# Altium schematic sheet connectors.SchDoc
size A3
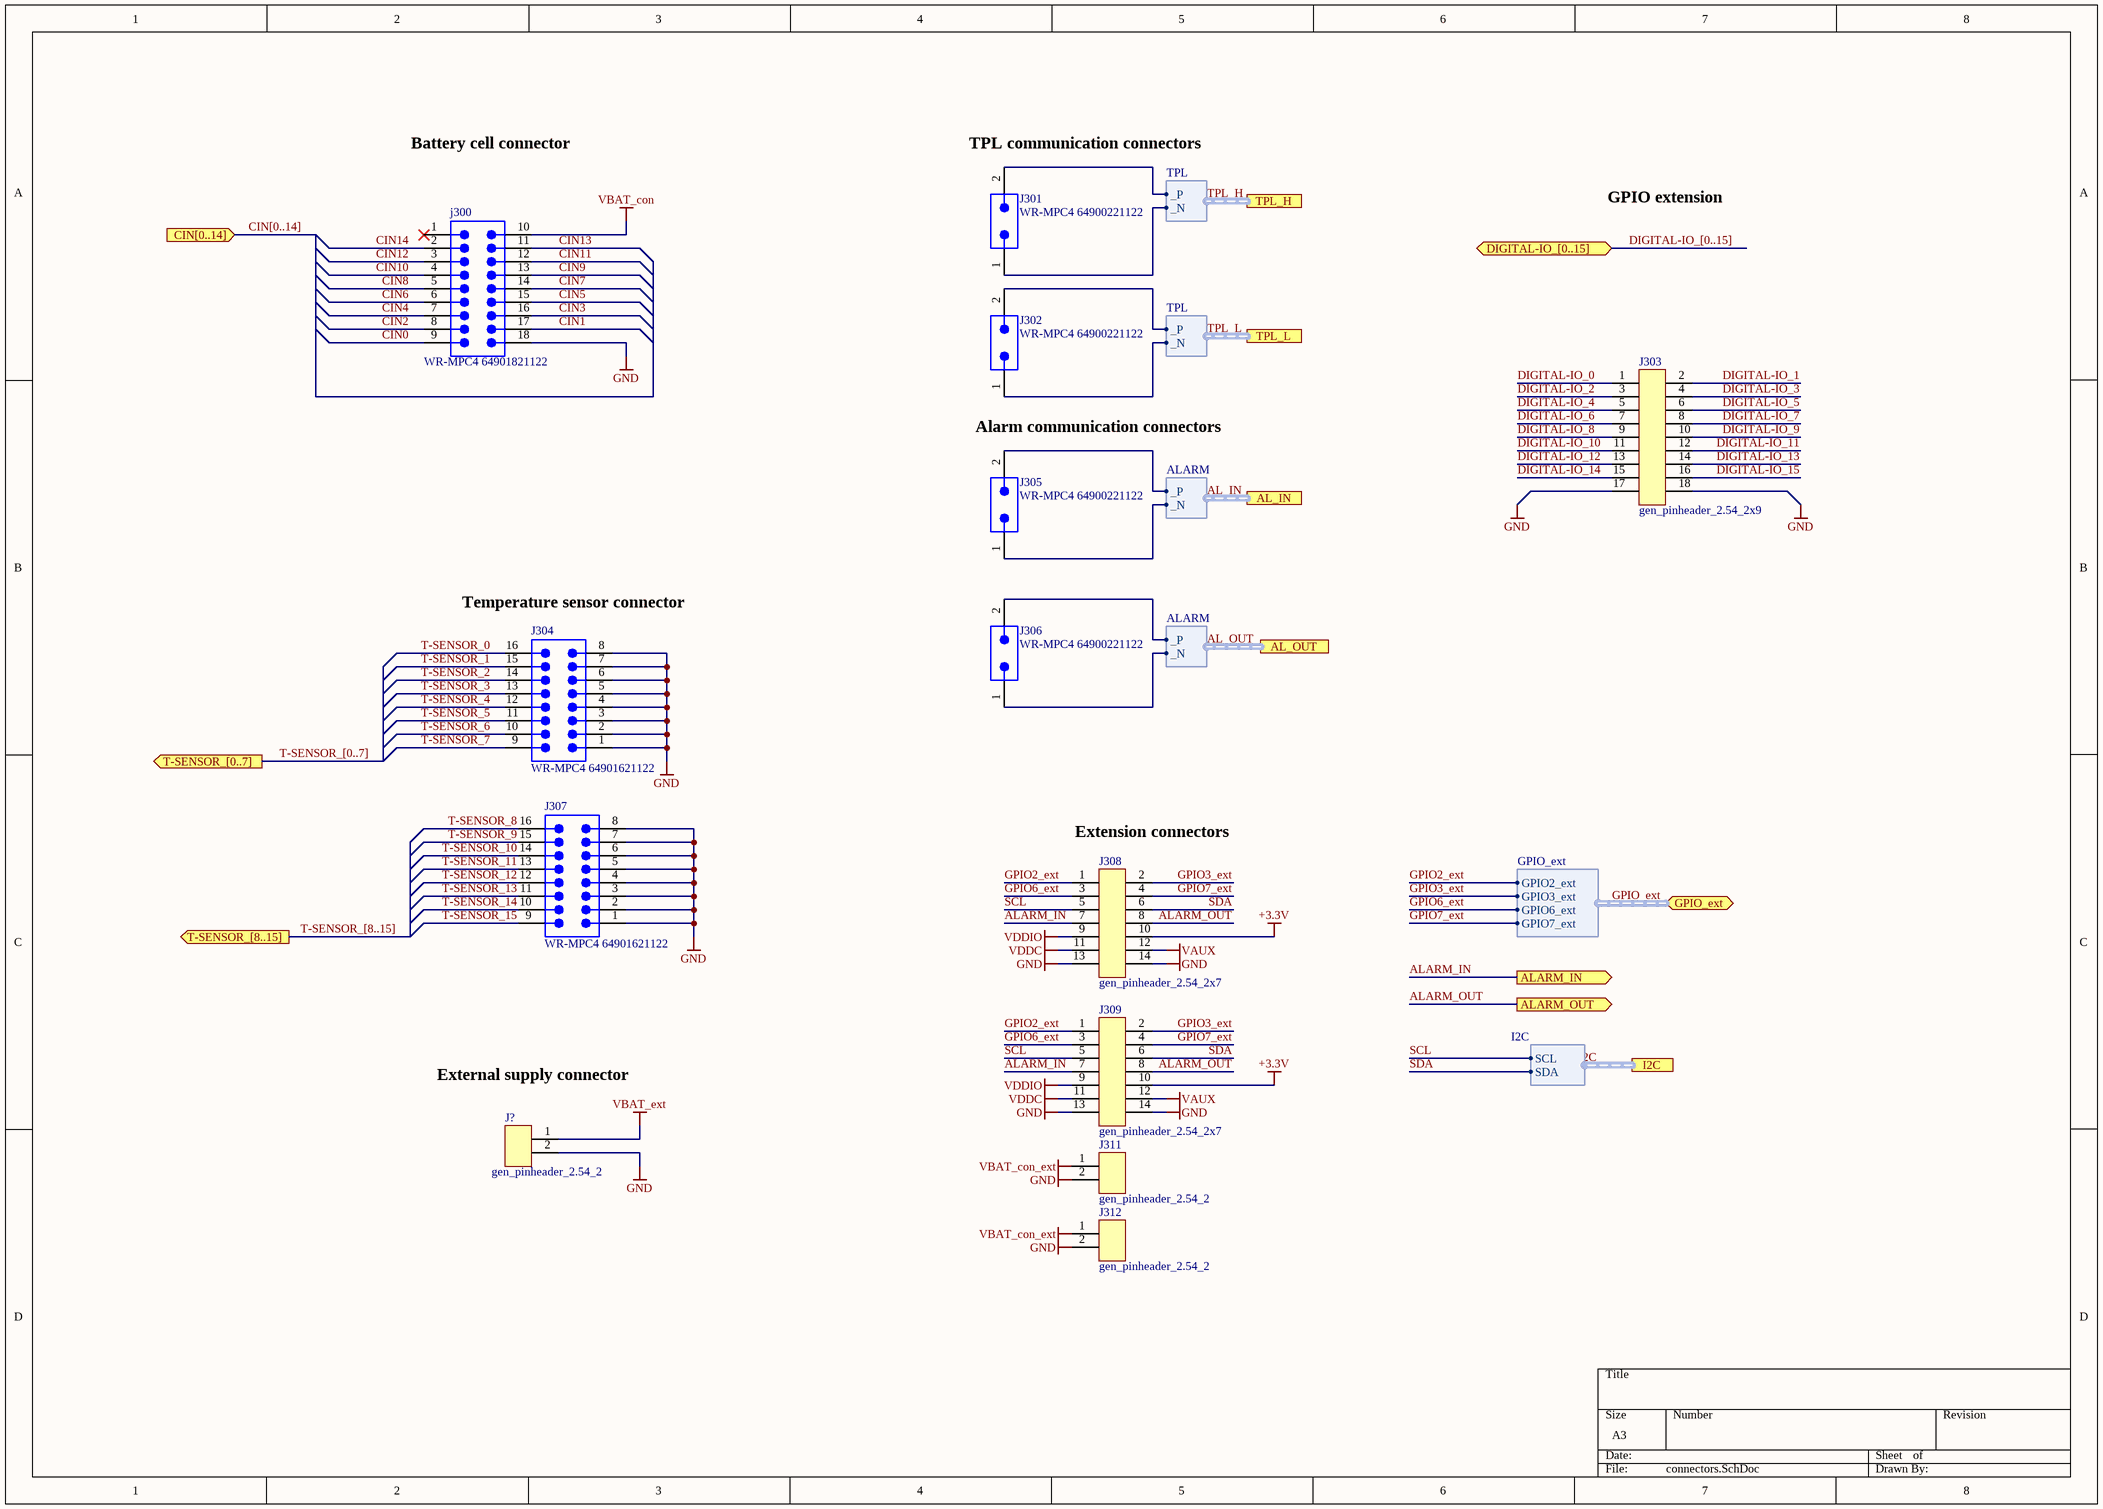
[diagram p0: connectors.SchDoc]

## Parts
j300  WR-MPC4 64901821122  [64901821122]
J301  WR-MPC4 64900221122  [64900221122]
J302  WR-MPC4 64900221122  [64900221122]
J303  gen_pinheader_2.54_2x9  [Pinheader_2.54_2x9]
J304  WR-MPC4 64901621122  [64901621122]
J305  WR-MPC4 64900221122  [64900221122]
J306  WR-MPC4 64900221122  [64900221122]
J307  WR-MPC4 64901621122  [64901621122]
J308  gen_pinheader_2.54_2x7  [Pinheader_2.54_2x7]
J309  gen_pinheader_2.54_2x7  [Pinheader_2.54_2x7]
J311  gen_pinheader_2.54_2  [Pinheader_2.54_2]
J312  gen_pinheader_2.54_2  [Pinheader_2.54_2]
J?  gen_pinheader_2.54_2  [Pinheader_2.54_2]

## Ports
AL_IN (harness ALARM), AL_OUT (harness ALARM), ALARM_IN (out), ALARM_OUT (out), CIN[0..14] (in), DIGITAL-IO_[0..15] (bidir), GPIO_ext (bidir, harness GPIO_ext), I2C (harness I2C), T-SENSOR_[0..7] (out), T-SENSOR_[8..15] (out), TPL_H (harness TPL), TPL_L (harness TPL)

## Harnesses
GPIO_ext: GPIO3_ext, GPIO2_ext, GPIO6_ext, GPIO7_ext
I2C: SCL, SDA
TPL: _P, _N
ALARM: _P, _N

## Nets
+3.3V: J308.10 J309.10
GND: j300.18 J303.17 J303.18 J304.1 J304.2 J304.3 J304.4 J304.5 J304.6 J304.7 J304.8 J307.1 J307.2 J307.3 J307.4 J307.5 J307.6 J307.7 J307.8 J308.13 J308.14 J309.13 J309.14 J311.2 J312.2 J?.2
VAUX: J308.12 J309.12
VBAT_con: j300.10
VBAT_con_ext: J311.1 J312.1
VBAT_ext: J?.1
VDDC: J308.11 J309.11
VDDIO: J308.9 J309.9
AL_IN._N: J305.1 ; port AL_IN._N
AL_IN._P: J305.2 ; port AL_IN._P
AL_OUT._N: J306.1 ; port AL_OUT._N
AL_OUT._P: J306.2 ; port AL_OUT._P
ALARM_IN: J308.7 J309.7 ; port ALARM_IN
ALARM_OUT: J308.8 J309.8 ; port ALARM_OUT
CIN0: j300.9
CIN1: j300.17
CIN2: j300.8
CIN3: j300.16
CIN4: j300.7
CIN5: j300.15
CIN6: j300.6
CIN7: j300.14
CIN8: j300.5
CIN9: j300.13
CIN10: j300.4
CIN11: j300.12
CIN12: j300.3
CIN13: j300.11
CIN14: j300.2
DIGITAL-IO_0: J303.1
DIGITAL-IO_1: J303.2
DIGITAL-IO_2: J303.3
DIGITAL-IO_3: J303.4
DIGITAL-IO_4: J303.5
DIGITAL-IO_5: J303.6
DIGITAL-IO_6: J303.7
DIGITAL-IO_7: J303.8
DIGITAL-IO_8: J303.9
DIGITAL-IO_9: J303.10
DIGITAL-IO_10: J303.11
DIGITAL-IO_11: J303.12
DIGITAL-IO_12: J303.13
DIGITAL-IO_13: J303.14
DIGITAL-IO_14: J303.15
DIGITAL-IO_15: J303.16
GPIO2_ext: J308.1 J309.1 ; port GPIO_ext.GPIO2_ext
GPIO3_ext: J308.2 J309.2 ; port GPIO_ext.GPIO3_ext
GPIO6_ext: J308.3 J309.3 ; port GPIO_ext.GPIO6_ext
GPIO7_ext: J308.4 J309.4 ; port GPIO_ext.GPIO7_ext
SCL: J308.5 J309.5 ; port I2C.SCL  [project net I2C.SCL]
SDA: J308.6 J309.6 ; port I2C.SDA  [project net I2C.SDA]
T-SENSOR_0: J304.16
T-SENSOR_1: J304.15
T-SENSOR_2: J304.14
T-SENSOR_3: J304.13
T-SENSOR_4: J304.12
T-SENSOR_5: J304.11
T-SENSOR_6: J304.10
T-SENSOR_7: J304.9
T-SENSOR_8: J307.16
T-SENSOR_9: J307.15
T-SENSOR_10: J307.14
T-SENSOR_11: J307.13
T-SENSOR_12: J307.12
T-SENSOR_13: J307.11
T-SENSOR_14: J307.10
T-SENSOR_15: J307.9
TPL_H._N: J301.1 ; port TPL_H._N
TPL_H._P: J301.2 ; port TPL_H._P
TPL_L._N: J302.1 ; port TPL_L._N
TPL_L._P: J302.2 ; port TPL_L._P

Not connected (* = marked no-connect by the designer): j300 1*

## Buses and harness runs
bus CIN[0..14] = port CIN[0..14]
bus DIGITAL-IO_[0..15] = port DIGITAL-IO_[0..15]
bus T-SENSOR_[0..7] = port T-SENSOR_[0..7]
bus T-SENSOR_[8..15] = port T-SENSOR_[8..15]
harness AL_IN = port AL_IN
harness AL_OUT = port AL_OUT
harness GPIO_ext = port GPIO_ext
harness I2C = port I2C
harness TPL_H = port TPL_H
harness TPL_L = port TPL_L

## Notes on the sheet
- Battery cell connector
- (near J301) TPL communication connectors
- GPIO extension
- Alarm communication connectors
- (near J304) Temperature sensor connector
- (near J308) Extension connectors
- External supply connector

## Library data of the parts
j300 = CMP-1502-00501-2: NexarPartId: 23024638; Number of Positions: 18; Current Rating: 6A; Gender: Male; Operating Supply Voltage: 600V; Insulation Resistance: 1GΩ; Contact Resistance: 10mΩ; Connector Type: Male Pin, Socket; Row Spacing: 4.191mm; Pitch: 4.2mm; Color: White; Height: 12.8mm; Orientation: Vertical; Width: 39.1mm; Contact Material: Copper; Number of Contacts: 18; Max Operating Temperature: 105°C; Number of Rows: 2; RoHS: Compliant; Min Operating Temperature: -40°C; Contact Plating: Tin; Length: 39mm; Mount: Through Hole; Termination: Solder; Lead Pitch: 4.2mm; REACH SVHC: Unknown; Number of Pins: 18; Fastening Type: Ramp
J301 J302 J305 J306 = CMP-1502-00493-2: NexarPartId: 8917578; Contact Resistance: 10mΩ; Operating Supply Voltage: 600V; Current Rating: 9A; Gender: Male; Number of Contacts: 2; Lead Length: 3.5mm; Connector Type: Male Pin, Socket; Pitch: 4.2mm; Row Spacing: 5.5118mm; Insulation Resistance: 1GΩ; Height: 12.8mm; Max Operating Temperature: 105°C; Color: White; Number of Rows: 2; Voltage Rating: 600V; Termination: Solder; Fastening Type: Ramp; Width: 5.5mm; Min Operating Temperature: -40°C; Length: 5.4mm; Mount: Through Hole; Flammability Rating: UL94 V-0; Contact Gender: Male; Contact Material: Copper; Lead Pitch: 4.2mm; Housing Material: Nylon; Contact Plating: Tin; Number of Pins: 2; RoHS: Compliant; Orientation: Vertical; REACH SVHC: Unknown; Number of Positions: 2
J303 = gen_pinheader_2.54_2x9: Standard Pinheader, THD, gerade, 2.54mm, 2-reihig; Circuits: 18; Rated Voltage: 250V; Rated Current: 3A; Automotive Qualified: False; Part Number: gen_pinheader_2.54_2x9; Part Name: PinHeader; Operating Temperature: −40 °C - +105 °C; Supplier 1: Farnell; Supplier Part Number 1: 2025256
J304 J307 = CMP-1502-00500-2: NexarPartId: 23024631; Pitch: 4.2mm; Gender: Male; Row Spacing: 4.191mm; Operating Supply Voltage: 600V; Insulation Resistance: 1GΩ; Connector Type: Male Pin, Socket; Contact Resistance: 10mΩ; Number of Positions: 16; Current Rating: 6A; Fastening Type: Ramp; Lead Pitch: 4.2mm; REACH SVHC: Unknown; Number of Pins: 16; RoHS: Compliant; Color: White; Mount: Through Hole; Contact Material: Copper; Width: 34.9mm; Max Operating Temperature: 105°C; Min Operating Temperature: -40°C; Height: 12.8mm; Termination: Solder; Orientation: Vertical; Length: 34.8mm; Contact Plating: Tin; Number of Rows: 2; Number of Contacts: 16
J308 J309 = gen_pinheader_2.54_2x7: Standard Pinheader, THD, gerade, 2.54mm, 2-reihig; Circuits: 14; Rated Voltage: 250V; Rated Current: 3A; Automotive Qualified: False; Part Number: gen_pinheader_2.54_2x7; Part Name: PinHeader; Operating Temperature: −40 °C - +105 °C; Supplier 1: Mouser; Supplier Part Number 1: 200-TSW10707GD
J311 J312 J? = gen_pinheader_2.54_2: Standard Pinheader, THD, gerade, 2.54mm; Circuits: 2; Rated Voltage: 250V; Rated Current: 3A; Automotive Qualified: False; Part Number: gen_pinheader_2.54_2; Part Name: PinHeader; Operating Temperature: −40 °C - +105 °C; Supplier 1: Farnell; Supplier Part Number 1: 2505044